# Altium schematic sheet Power.SchDoc
size A4; DocumentNumber: 3; SheetNumber: 3; SheetTotal: 4
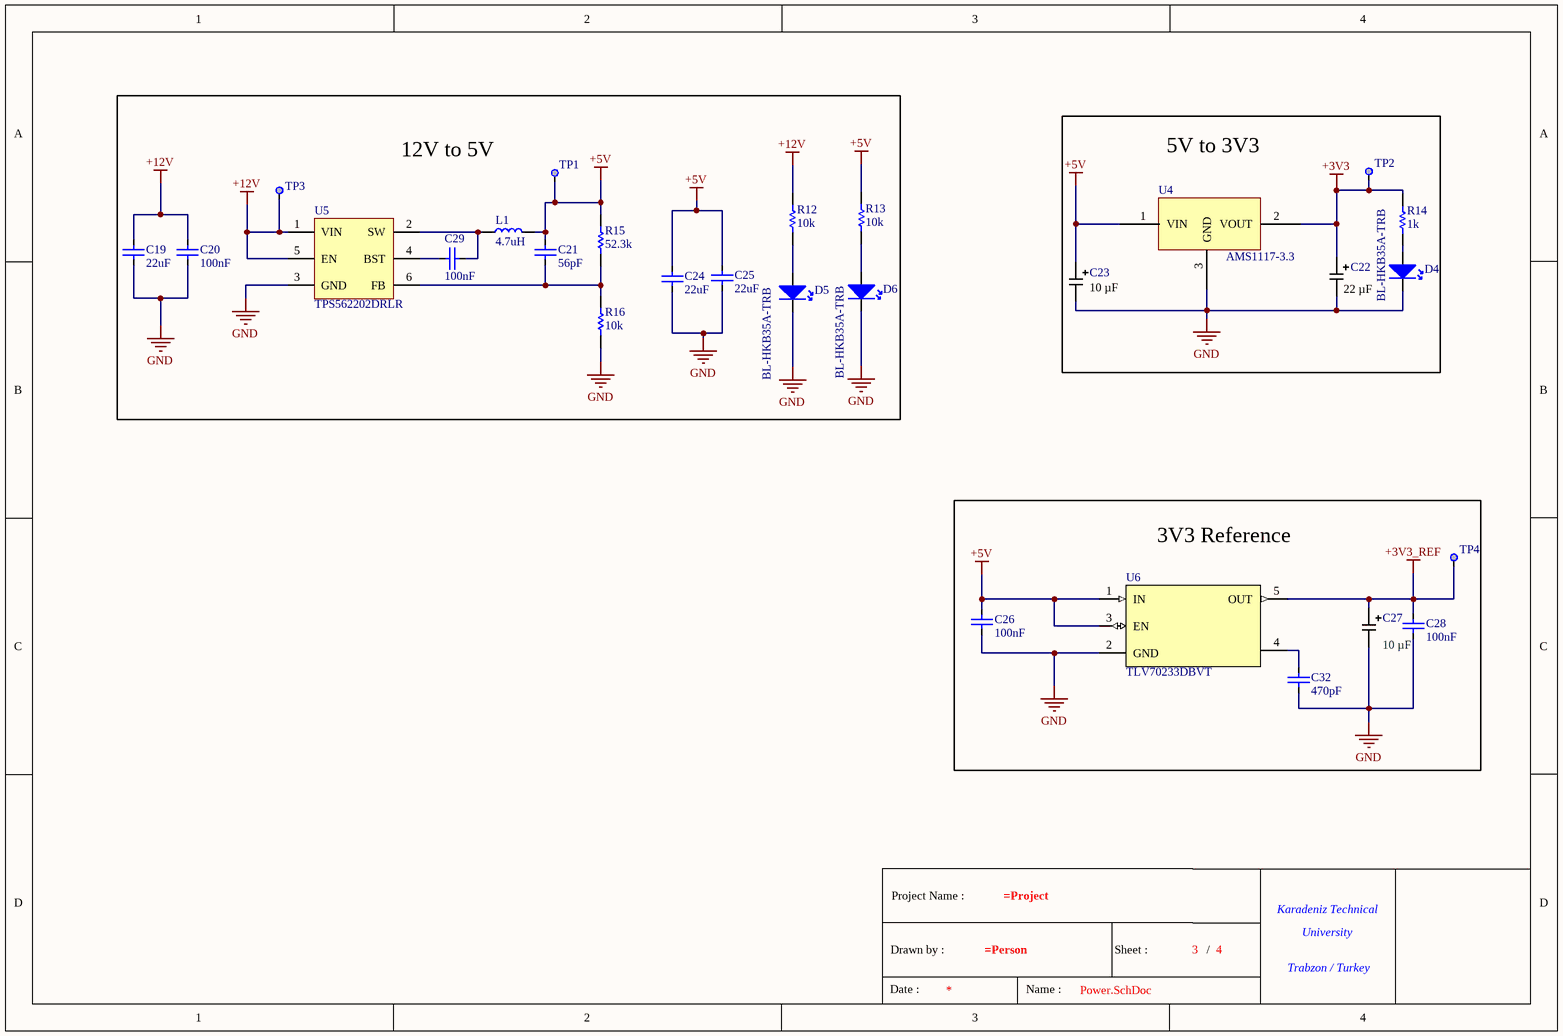
[diagram p0: Power.SchDoc]

## Parts
*  Title Block  (value not drawn)  (graphical)
C19  22uF  [CAP-1210]
C20  100nF  [CAP-0603]
C21  56pF  [CAP-0603]
C22  Capacitance: 22 µF  [KEMET_CAP_TAN-B]  (hidden comment: T491B226K020AT)
C23  Capacitance: 10 µF  [KEMET_CAP_TAN-B]  (hidden comment: T491B106M016AT)
C24  22uF  [CAP-1210]
C25  22uF  [CAP-1210]
C26  100nF  [CAP-0603]
C27  Capacitance: 10 µF  [KEMET_CAP_TAN-B]  (hidden comment: T491B106M016AT)
C28  100nF  [CAP-0603]
C29  100nF  [CAP-0603]
C32  470pF  [CAP-0603]
D4  BL-HKB35A-TRB  [LED-0805]
D5  BL-HKB35A-TRB  [LED-0805]
D6  BL-HKB35A-TRB  [LED-0805]
L1  4.7uH  [IND_EATON_DR125-4R7-R]
R12  10k  [RES-0603]
R13  10k  [RES-0603]
R14  1k  [RES-0603]
R15  52.3k  [RES-0603]
R16  10k  [RES-0603]
TP1  Test Point  [0.8mm Test Point]  (value not drawn)  (no BOM)
TP2  Test Point  [0.8mm Test Point]  (value not drawn)  (no BOM)
TP3  Test Point  [0.8mm Test Point]  (value not drawn)  (no BOM)
TP4  Test Point  [0.8mm Test Point]  (value not drawn)  (no BOM)
U4  AMS1117-3.3  [SOT-223]
U5  TPS562202DRLR  [SOT-563]
U6  TLV70233DBVT  [SOT23-5]

## Blocks framed on the sheet
12V to 5V: C19-C21 C24 C25 C29 D5 D6 L1 R12 R13 R15 R16 TP1 TP3 U5
5V to 3V3: C22 C23 D4 R14 TP2 U4
3V3 Reference: C26-C28 C32 TP4 U6

## Nets
+3V3: C22.1 R14.1 TP2.1 U4.2(VOUT)
+3V3_REF: C27.1 C28.2 TP4.1 U6.5(OUT)
+5V: C21.2 C23.1 C24.2 C25.2 C26.2 L1.2 R13.2 R15.2 TP1.1 U4.1(VIN) U6.1(IN) U6.3(EN)
+12V: C19.2 C20.2 R12.2 TP3.1 U5.1(VIN) U5.5(EN)
GND: C19.1 C20.1 C22.2 C23.2 C24.1 C25.1 C26.1 C27.2 C28.1 C32.1 D4.2(K) D5.2(K) D6.2(K) R16.1 U4.3(GND) U5.3(GND) U6.2(GND)
NetC21_1: C21.1 R15.1 R16.2 U5.6(FB)
NetC29_1: C29.1 L1.1 U5.2(SW)
NetC29_2: C29.2 U5.4(BST)
NetC32_2: C32.2 U6.4
NetD4_1: D4.1(A) R14.2
NetD5_1: D5.1(A) R12.1
NetD6_1: D6.1(A) R13.1

## Notes on the sheet
- (in symbol Title Block) Project Name :; Karadeniz Technical; University; Drawn by :; Sheet :; /; Trabzon / Turkey; Date :; Name :

## Library data of the parts
* = Title Block: Standart Title Block
C19 C24 C25 = CL32B226KAJNNNE: Manufacturer: Samsung Electro-Mechanics; Temperature Coefficient: X7R; Voltage: 25V; Library Reference: Capacitor; Tolerance: %10; Man Code: CL32B226KAJNNNE; Value: 22uF; Footprint: 1210; Component Type: Ceramic Capacitor
C20 C26 C28 C29 = CGA3E2X7R1H104K080AA: Manufacturer: TDK; Temperature Coefficient: X7R; Voltage: 50V; Library Reference: Capacitor; Tolerance: %10; Man Code: CGA3E2X7R1H104K080AA; Value: 100nF; Footprint: 0603; Component Type: Ceramic Capacitor
C21 = GCM1885C2A560FA16D: Manufacturer: Murata; Library Reference: Capacitor; Tolerance: %1; Temperature Coefficient: C0G; Voltage: 100V; Man Code: GCM1885C2A560FA16D; Value: 56pF; Footprint: 0603; Component Type: Ceramic Capacitor
C22 = T491B226K020AT: CAP TANT 22UF 10% 20V 1411; Manufacturer: KEMET; Manufacturer Size Code: B; Type: Molded; ESR (Equivalent Series Resistance): 4 Ohm; Lifetime @ Temp.: 2000 Hrs @ 125°C; Series: T491; Package: Tape & Reel (TR); Tolerance: ±10%; Operating Temperature: -55°C ~ 125°C; Mounting Type: Surface Mount; Package / Case: 1411 (3528 Metric); Size / Dimension: 0.138" L x 0.110" W (3.50mm x 2.80mm); Height - Seated (Max): 0.083" (2.10mm); Lead Spacing: -; Ratings: -; Features: General Purpose; Failure Rate: -; Voltage - Rated: 20 V; Ozdisan Link: https://ozdisan.com/pasif-komponentler/kondansatorler/tantal-kondansatorler/T491B226K020AT; Digikey Link: https://www.digikey.com/en/products/detail/kemet/T491B226K020AT/1842086; Farnell TR Link: https://tr.farnell.com/kemet/t491b226k020at/cap-22-f-20v-10/dp/2321214?st=t491b226k020at; Mouser Link: https://www.mouser.com.tr/ProductDetail/KEMET/T491B226K020AT?qs=2QcrrtqkWlnFmgDgM5wdlA%3D%3D
C23 C27 = T491B106M016AT: CAP TANT 10UF 20% 16V 1411; Manufacturer: KEMET; Manufacturer Size Code: B; Type: Molded; ESR (Equivalent Series Resistance): 2.5 Ohm; Lifetime @ Temp.: 2000 Hrs @ 125°C; Series: T491; Package: Tape & Reel (TR); Tolerance: ±20%; Operating Temperature: -55°C ~ 125°C; Mounting Type: Surface Mount; Package / Case: 1411 (3528 Metric); Size / Dimension: 0.138" L x 0.110" W (3.50mm x 2.80mm); Height - Seated (Max): 0.083" (2.10mm); Lead Spacing: -; Ratings: -; Features: General Purpose; Failure Rate: -; Voltage - Rated: 16 V; Ozdisan Link: https://ozdisan.com/pasif-komponentler/kondansatorler/tantal-kondansatorler/T491B106M016AT; Digikey Link: https://www.digikey.com/en/products/detail/kemet/T495B475M025ZTE750/8764094; Farnell TR Link: https://tr.farnell.com/kemet/t491b106m016at/cap-10-f-16v-20/dp/2462772?st=t491b106m016at; Mouser Link: https://www.mouser.com.tr/ProductDetail/KEMET/T491B106M016AT?qs=WydH9nGI6cAnkEyQJLjSzA%3D%3D
C32 = CL10B471KB8NNNC: Manufacturer: Samsung; Voltage: 50V; Tolerance: %10; Component Type: Capacitor; Footprint: 0603; Man Code: CL10B471KB8NNNC; Value: 470pF
D4-D6 = BL-HKB35A-TRB: Manufacturer: BRIGHT LED; Colour: Yellow; Vf: 2.2V; Library Reference: Miscellaneous; Luminous Intensity: 94mcd; If: 20mA; Lens Transparency: Water Clear; Man Code: BL-HKB35A-TRB; Footprint: 0805; Component Type: Led
L1 = DR125-4R7-R: Manufacturer: Eaton; Max Dc Resistance: 10.5mOhm; Tolerance: %20; Max DC Current: 7.18A; Library Reference: Inductor; Man Code: DR125-4R7-R; Value: 4.7uH; Footprint: Surface Mount (12.5mm* 12.5mm); Component Type: Fixed Inductor
R12 R13 R16 = CRCW060310K0FKEA: Manufacturer: Vishay; Tolerance: %1; Power: 0.1W; Library Reference: Resistor; Man Code: CRCW060310K0FKEA; Value: 10k; Footprint: 0603; Component Type: Chip Resistor
R14 = CRCW06031K00FKEAC: Manufacturer: Vishay; Library Reference: Resistor; Tolerance: %1; Power: 0.1W; Man Code: CRCW06031K00FKEAC; Footprint: 0603; Component Type: Chip Resistor; Value: 1k
R15 = ERJ-3EKF5232V: Manufacturer: Panasonic; Tolerance: %1; Power: 0.1W; Library Reference: Resistor; Man Code: ERJ-3EKF5232V; Value: 52.3k; Footprint: 0603; Component Type: Chip Resistor
TP1-TP4 = Test Point: Library Reference: Miscellaneous; Component Type: Test Point
U4 = AMS1117-3.3: Manufacturer: Monolithic; Componenet Type: Regulator; Output Voltage: 3.3V; Output Current: 1A; Man Code: AMS1117-3.3
U5 = TPS562202DRLR: Manufacturer: Texas Instruments; Library Reference: Integrated_Circuit; Man Code: TPS562202DRLR; Component Type: Switcher
U6 = TLV70233DBVT: Manufacturer: TEXAS; Current: 300mA; Voltage: 3.3V; Component Type: LDO; Man Code: TLV70233DBVT